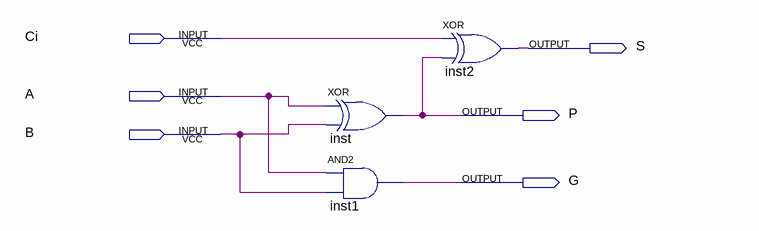
[diagram p0: schematic sheet]
// Quartus schematic simple_adder.bdf as structural Verilog: 3 symbols, 6 pins
module simple_adder (
  input  Ci,
  input  A,
  input  B,
  output S,
  output P,
  output G
);

  xor inst (P, A, B);
  and inst1 (G, A, B);
  xor inst2 (S, Ci, P);
endmodule
